# EasyEDA Pro project ACDC_双向.eprj, board 三相（TO-277）
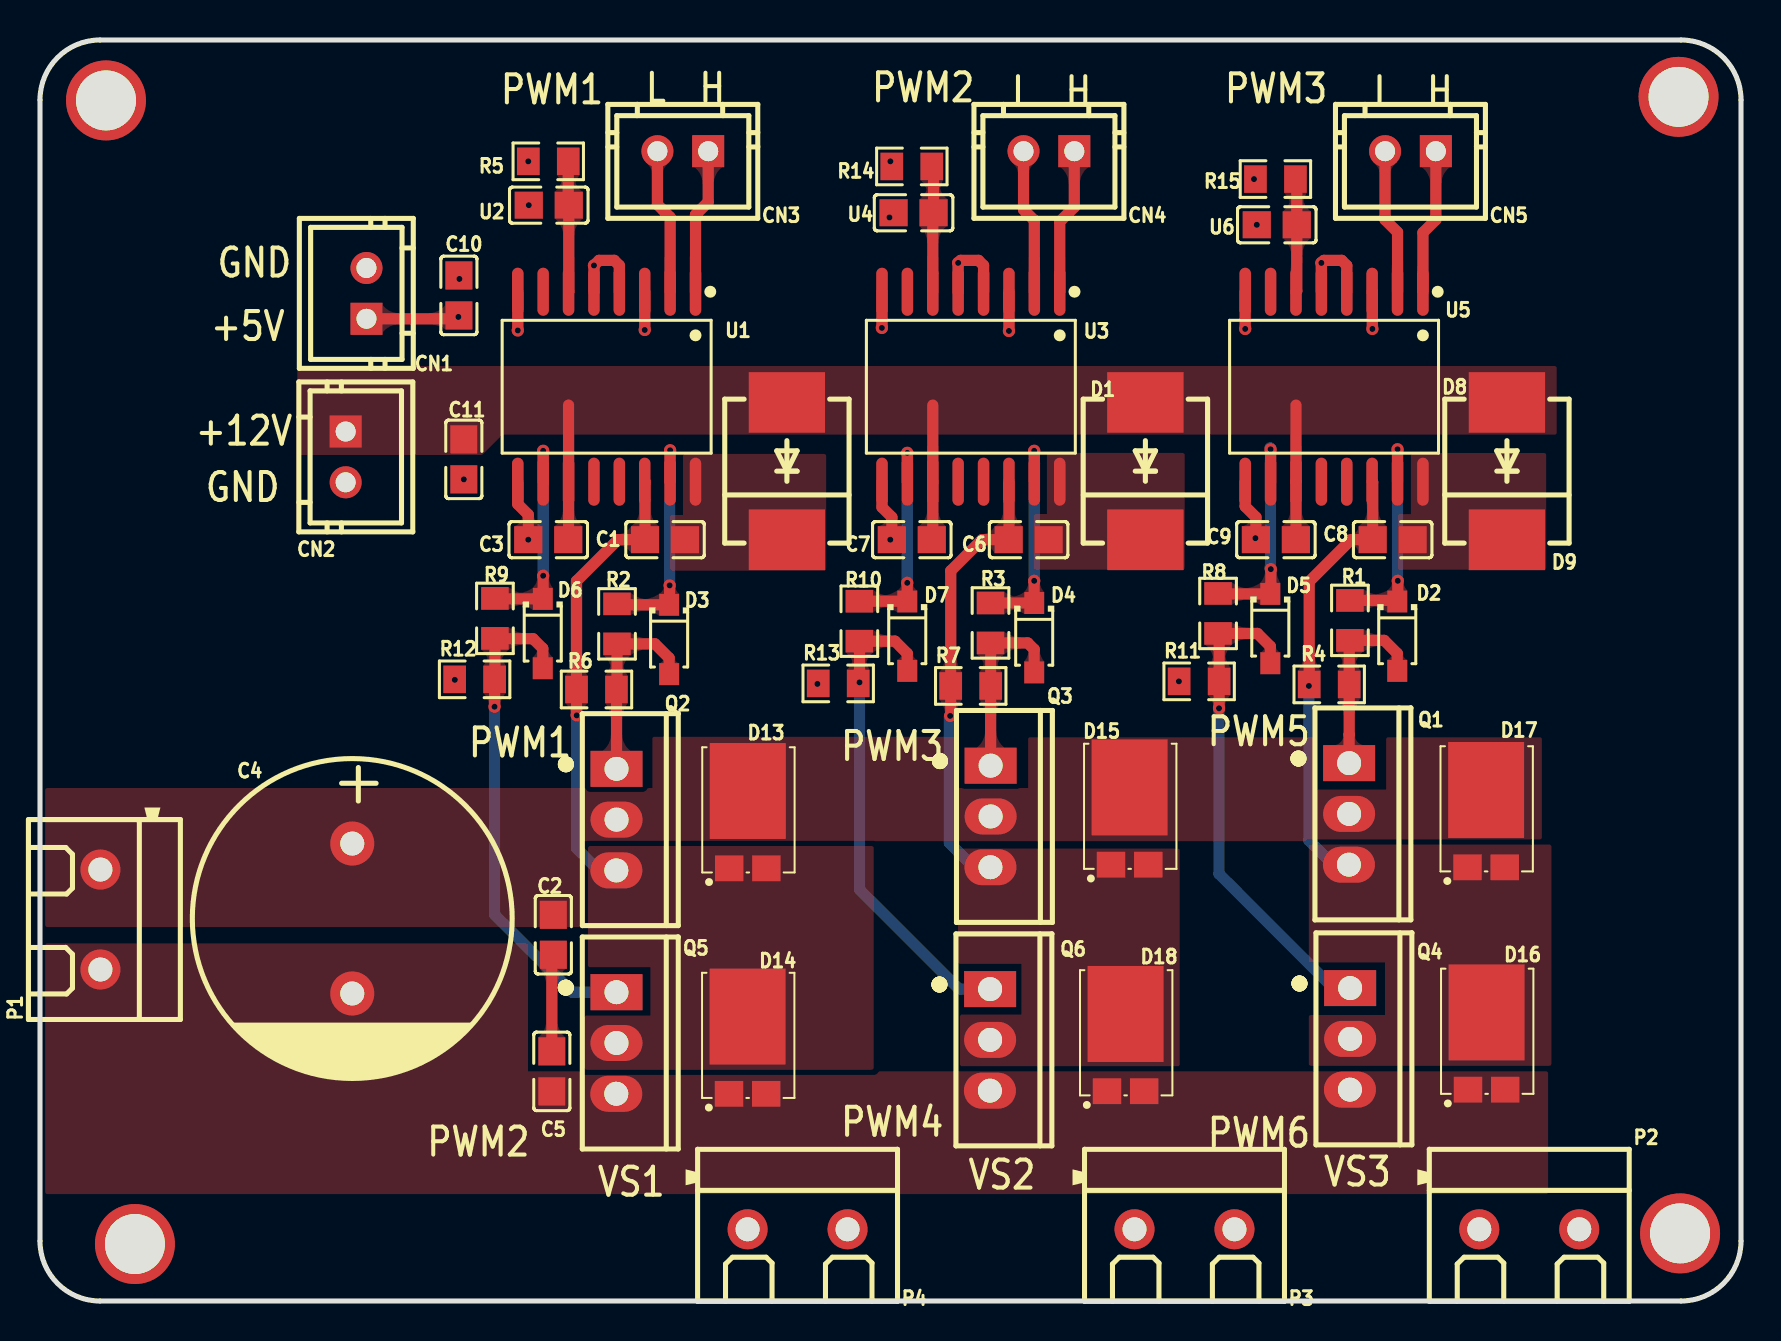
[diagram p11: board, top side]
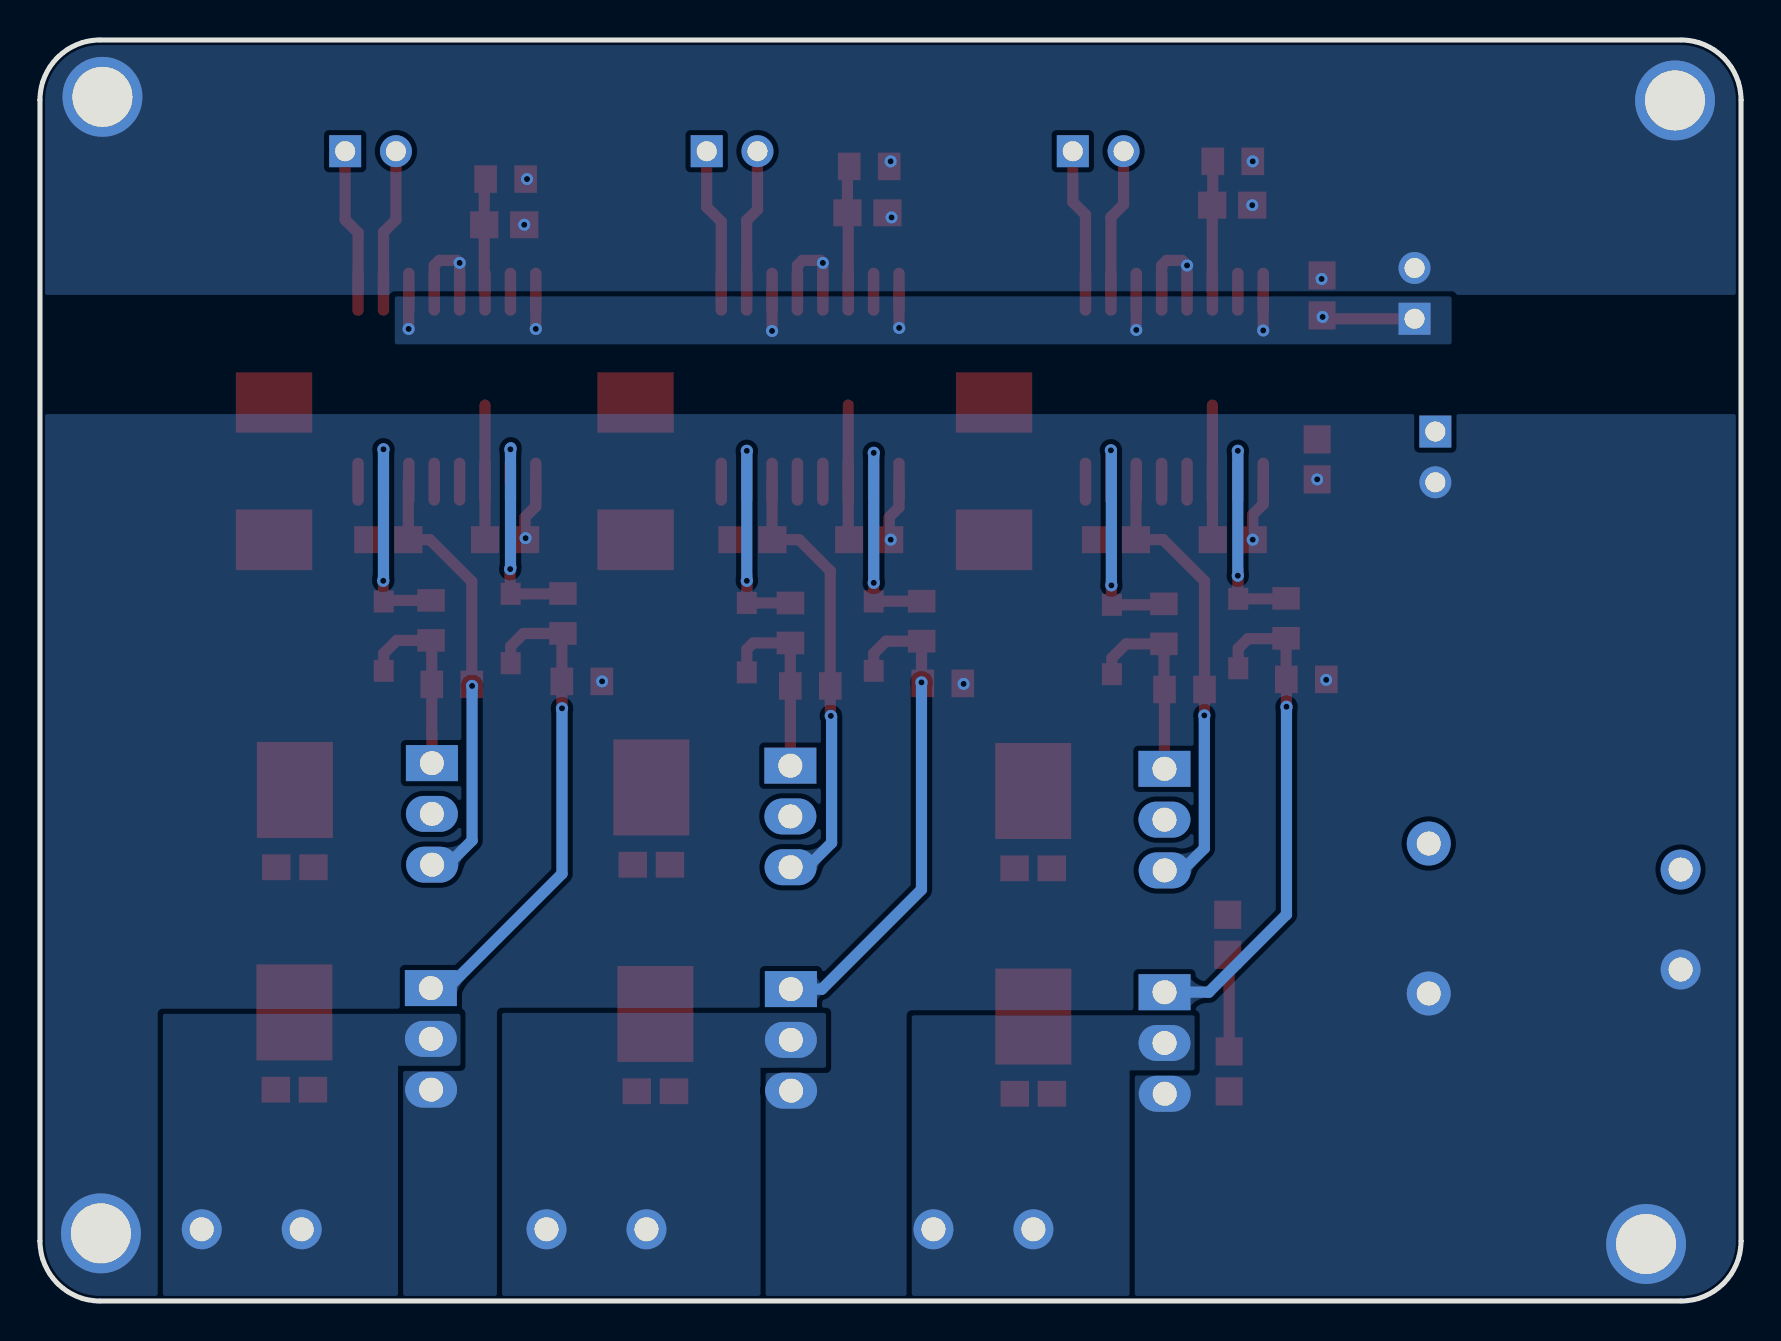
[diagram p12: board, bottom side, seen from below]

Outline 85.09 x 63.07 mm; copper layers: Top Layer, Bottom Layer. Coordinates in mm from the lower left corner of the outline.
Outline path: 0,60.07 0,3 arc(0.88,0.88) 3,0 82.09,0 arc(84.21,0.88) 85.09,3 85.09,60.07 arc(84.21,62.19) 82.09,63.07 3,63.07 arc(0.88,62.19) 0,60.07
Stack: Top Layer 0.035mm / Dielectric1 1.51mm FR4 er 4.5 / Bottom Layer 0.035mm

## Design rules (mm)
template: 自定义配置
spacing copperThickness1oz (default): track to track 0.102, other pairs 0.152 to 0.3
spacing copperThickness2oz: track to track 0.203, other pairs 0.152 to 0.3
track width copperThickness1oz (default): min 0.127, default 0.254, max 2.54
track width copperThickness2oz: min 0.203, default 0.254, max 2.54
differential pair differentialPair (default): width min 0.127, default 0.254, max 2.54; gap min 0.152, default 0.152
via viaSize (default): diameter min 0.5, default 0.61, max 10; hole min 0.3, default 0.305, max 6.3

## Placement (name value [footprint] x y rotation side)
C1  1uF  [C0805]  31.27 38.08 0 top
C2  100nF  [C0805]  25.68 18.32 90 top
C3  1uF  [C0805]  25.42 38.08 0 top
C4  470uF  [CAP-TH_BD16.0-P7.50-D1.2-FD]  15.62 19.13 270 top
C5  100nF  [C0805]  25.6 11.49 90 top
C6  1uF  [C0805]  49.45 38.08 0 top
C7  1uF  [C0805]  43.61 38.08 0 top
C8  1uF  [C0805]  67.67 38.08 0 top
C9  1uF  [C0805]  61.82 38.08 0 top
C10  100nF  [C0805]  20.95 50.3 270 top
C11  100nF  [C0805]  21.2 42.1 90 top
CN1  CON2-2.54*2P  [CONN-TH_2P-P2.54-V]  16.33 50.4 90 top
CN2  CON2-2.54*2P  [CONN-TH_2P-P2.54-V]  15.29 42.22 270 top
CN3  CON2-2.54*2P  [CONN-TH_2P-P2.54-V]  32.16 57.51 180 top
CN4  CON2-2.54*2P  [CONN-TH_2P-P2.54-V]  50.47 57.51 180 top
CN5  CON2-2.54*2P  [CONN-TH_2P-P2.54-V]  68.55 57.51 180 top
D1  RS3MC  [SMC_L7.1-W6.2-LS8.1-R-RD]  37.36 41.51 90 top
D2  1N4148W  [SOD-123F_L2.7-W1.6-LS3.8-RD]  67.89 33.25 270 top
D3  1N4148W  [SOD-123F_L2.7-W1.6-LS3.8-RD]  31.47 33.09 270 top
D4  1N4148W  [SOD-123F_L2.7-W1.6-LS3.8-RD]  49.73 33.18 270 top
D5  1N4148W  [SOD-123F_L2.7-W1.6-LS3.8-RD]  61.54 33.63 270 top
D6  1N4148W  [SOD-123F_L2.7-W1.6-LS3.8-RD]  25.15 33.39 270 top
D7  1N4148W  [SOD-123F_L2.7-W1.6-LS3.8-RD]  43.38 33.25 270 top
D8  RS3MC  [SMC_L7.1-W6.2-LS8.1-R-RD]  55.3 41.51 90 top
D9  RS3MC  [SMC_L7.1-W6.2-LS8.1-R-RD]  73.38 41.51 90 top
D13  ST20100L  [TO-277_3P-L5.7-W4.2-LS6.5-BR]  35.41 23.58 270 top
D14  ST20100L  [TO-277_3P-L5.7-W4.2-LS6.5-BR]  35.4 12.3 270 top
D15  ST20100L  [TO-277_3P-L5.7-W4.2-LS6.5-BR]  54.51 23.75 270 top
D16  ST20100L  [TO-277_3P-L5.7-W4.2-LS6.5-BR]  72.36 12.5 270 top
D17  ST20100L  [TO-277_3P-L5.7-W4.2-LS6.5-BR]  72.34 23.63 270 top
D18  ST20100L  [TO-277_3P-L5.7-W4.2-LS6.5-BR]  54.31 12.43 270 top
NOREF  -  [Pad_e102]  82.04 3.38 0 top
NOREF#2  -  [Pad_e101]  4.75 2.85 0 top
NOREF#3  -  [Pad_e100]  81.97 60.23 0 top
NOREF#4  -  [Pad_e98]  3.3 60.05 0 top
P1  KF301-2P接线端子  [CONN-TH_XY301V-A-5.0-2P]  3.02 19.08 90 top
P2  KF301-2P接线端子  [CONN-TH_XY301V-A-5.0-2P]  74.5 3.59 180 top
P3  KF301-2P接线端子  [CONN-TH_XY301V-A-5.0-2P]  57.25 3.59 180 top
P4  KF301-2P接线端子  [CONN-TH_XY301V-A-5.0-2P]  37.9 3.59 180 top
Q1  CSD19536KCS  [TO-220-3_L10.0-W4.5-P2.54-L]  65.48 24.36 270 top
Q2  CSD19536KCS  [TO-220-3_L10.0-W4.5-P2.54-L]  28.84 24.08 270 top
Q3  CSD19536KCS  [TO-220-3_L10.0-W4.5-P2.54-L]  47.55 24.24 270 top
Q4  CSD19536KCS  [TO-220-3_L10.0-W4.5-P2.54-L]  65.53 13.11 270 top
Q5  CSD19536KCS  [TO-220-3_L10.0-W4.5-P2.54-L]  28.83 12.91 270 top
Q6  CSD19536KCS  [TO-220-3_L10.0-W4.5-P2.54-L]  47.52 13.06 270 top
R1  2Ω  [R0805]  65.53 34.04 270 top
R2  2Ω  [R0805]  28.87 33.87 270 top
R3  2Ω  [R0805]  47.55 33.91 270 top
R4  10kΩ  [R0805]  64.49 30.84 0 top
R5  20kΩ  [R0805]  25.42 57 0 top
R6  10kΩ  [R0805]  27.84 30.59 0 top
R7  10kΩ  [R0805]  46.56 30.76 0 top
R8  2Ω  [R0805]  58.93 34.39 270 top
R9  2Ω  [R0805]  22.76 34.14 270 top
R10  2Ω  [R0805]  40.99 34 270 top
R11  10kΩ  [R0805]  57.98 30.99 0 top
R12  10kΩ  [R0805]  21.74 31.09 0 top
R13  10kΩ  [R0805]  39.93 30.89 0 top
R14  20kΩ  [R0805]  43.61 56.75 0 top
R15  20kΩ  [R0805]  61.8 56.12 0 top
U1  UCC21520  [SOIC-16_L10.3-W7.5-P1.27-LS10.3-BL]  28.35 45.73 180 top
U2  100nF  [C0805]  25.45 54.81 0 top
U3  UCC21520  [SOIC-16_L10.3-W7.5-P1.27-LS10.3-BL]  46.56 45.73 180 top
U4  100nF  [C0805]  43.7 54.43 0 top
U5  UCC21520  [SOIC-16_L10.3-W7.5-P1.27-LS10.3-BL]  64.73 45.73 180 top
U6  100nF  [C0805]  61.87 53.83 0 top

## Footprints (pads in the part's own frame, mm; a bottom-side part is the same pattern mirrored in y, then rotated)
C0805
  rect 1.41x1.35 smd: 1(-1,0) 2(1,0)
CAP-TH_BD16.0-P7.50-D1.2-FD
  round 2.2 hole 1.2: 1(-3.75,0) 2(3.75,0)
CONN-TH_2P-P2.54-V
  rect 1.6x1.6 hole 1: 1(-1.27,0)
  round 1.6 hole 1: 2(1.27,0)
CONN-TH_XY301V-A-5.0-2P
  round 2 hole 1.2: 1(-2.5,0) 2(2.5,0)
Pad_e98
  round 4 hole 3: 1(0,0)
Pad_e100
  round 4 hole 3: 1(0,0)
Pad_e101
  round 4 hole 3: 1(0,0)
Pad_e102
  round 4 hole 3: 1(0,0)
R0805
  rect 1.133x1.377 smd: 1(-1,0) 2(1,0)
SMC_L7.1-W6.2-LS8.1-R-RD
  rect 3.03x3.82 smd: 1(3.435,0) 2(-3.435,0)
SOD-123F_L2.7-W1.6-LS3.8-RD
  rect 1.1x1 smd: 1(-1.735,0) 2(1.735,0)
SOIC-16_L10.3-W7.5-P1.27-LS10.3-BL
  oval 0.574x2.401 smd: 1(-4.445,-4.75) 2(-3.175,-4.75) 3(-1.905,-4.75) 4(-0.635,-4.75) 5(0.635,-4.75) 6(1.905,-4.75) 7(3.175,-4.75) 8(4.445,-4.75) 9(4.445,4.75) 10(3.175,4.75) 11(1.905,4.75) 12(0.635,4.75) 13(-0.635,4.75) 14(-1.905,4.75) 15(-3.175,4.75) 16(-4.445,4.75)
TO-220-3_L10.0-W4.5-P2.54-L
  rect 1.8x2.6 hole 1.2: 1(-2.54,0.005)
  oval 1.8x2.6 hole 1.2: 2(0,0.005) 3(2.54,-0.005)
TO-277_3P-L5.7-W4.2-LS6.5-BR
  rect 1.29x1.423 smd: 1(1.933,-0.93) 3(1.933,0.93)
  rect 4.8x3.8 smd: 2(-1.933,0)

## Nets
As in the schematic, except:
DGND: C10.1 CN1.2 NOREF#3.1 NOREF#4.1 R5.1 R14.1 R15.1 U1.4 U1.5 U2.1 U3.4 U3.5 U4.1 U5.4 U5.5 U6.1
PGND: C3.1 C4.2 C5.1 C7.1 C9.1 C11.1 CN2.2 D14.1 D14.3 D16.1 D16.3 D18.1 D18.3 NOREF.1 NOREF#2.1 P1.1 Q4.3 Q5.3 Q6.3 R11.1 R12.1 R13.1 U1.9 U3.9 U5.9

Pads without a net: U1 7 12 13; U3 7 12 13; U5 7 12 13

## Via types
v1: diameter 0.61, hole 0.305, Top Layer to Bottom Layer, 42 vias

## Routing (per net, layer and track width the routed paths; a pad name or vN(x,y) marks a point on that pad's centre or on a via; arc(x,y) is an arc through that point)
+5V: length 16
  Top Layer w0.559: v1(66.65,48.62) 66.65,50.47 U5.3 ; v1(20.93,49.22) 20.84,49.13 CN1.1 ; U5.8 v1(60.29,48.62) ; U1.3 v1(30.25,48.57) ; U3.8 42.12,48.68 v1(42.11,48.67) ; U3.3 v1(48.47,48.52) ; U1.8 v1(23.9,48.54)
+12V: length 20.2
  Top Layer w0.559: 44.66,44.81 U3.11 44.66,38.13 C7.2 ; C3.2 26.44,38.1 U1.11 26.44,44.81 ; C9.2 62.83,38.08 U5.11 62.83,44.81
DGND: length 12.5
  Top Layer w0.559: U1.5 v1(27.71,51.8) 27.97,52.05 28.73,52.05 28.98,51.8 U1.4 ; 64.1,50.48 v1(64.1,51.92) 64.22,52.05 65.11,52.05 65.37,51.8 U5.4 ; U3.4 47.2,51.8 46.95,52.05 46.06,52.05 v1(45.93,51.92) U3.5
  vias: v1(20.98,51.12) v1(24.42,57) v1(24.45,54.81) v1(42.49,54.2) v1(42.54,57) v1(60.73,56.12) v1(60.87,53.83)
PGND: length 9.5
  Top Layer w0.559: U3.9 42.12,39.7 42.61,39.21 C7.1 ; 60.82,38.16 61.04,38.16 ; 60.82,38.16 v1(60.8,38.16) ; 60.82,38.16 60.82,39.21 60.29,39.74 U5.9 ; v1(24.42,38.08) 24.42,39.33 23.9,39.86 U1.9
  vias: v1(20.75,31.07) v1(21.2,41.1) v1(38.89,30.87) v1(42.53,38.08) v1(56.97,30.99)
H1: length 11.9
  Top Layer w0.559: v1(31.5,35.79) 31.5,34.85 D3.1 28.91,34.82 R2.1 ; v1(31.52,42.55) U1.15
  Bottom Layer w0.559: v1(31.52,42.55) 31.5,42.52 v1(31.5,35.79)
H2: length 11.3
  Top Layer w0.559: v1(49.73,42.52) 49.74,42.52 U3.15 ; v1(49.73,36.02) 49.73,34.92 ; 49.73,34.91 R3.1
  Bottom Layer w0.559: v1(49.73,42.52) v1(49.73,36.02)
H3: length 11.6
  Top Layer w0.559: U5.15 v1(67.91,42.6) ; D2.1 67.84,35.04 67.79,35.04 ; 67.79,35.04 R1.1 ; 67.79,35.04 67.92,35.18 v1(67.92,36.02)
  Bottom Layer w0.559: v1(67.91,42.6) 67.91,36.03 v1(67.92,36.02)
L1: length 11.4
  Top Layer w0.559: U1.10 v1(25.17,42.52) ; R9.1 22.78,35.12 D6.1 25.17,35.14 v1(25.17,36.28)
  Bottom Layer w0.559: v1(25.17,42.52) v1(25.17,36.28)
L2: length 11.3
  Top Layer w0.559: v1(43.38,42.42) 43.39,42.42 U3.10 ; R10.1 43.37,35 D7.1 v1(43.38,35.92)
  Bottom Layer w0.559: v1(43.38,35.92) v1(43.38,42.42)
L3: length 11.5
  Top Layer w0.559: U5.10 v1(61.56,42.6) ; R8.1 58.95,35.37 D5.1 61.57,35.4 v1(61.57,36.61)
  Bottom Layer w0.559: 61.56,36.62 v1(61.57,36.61) ; 61.53,42.68 61.55,42.66 61.55,36.71 61.53,36.69
PWMH1: length 7.3
  Top Layer w0.559: 33.43,57.51 33.43,54.97 32.79,54.34 U1.1
PWMH2: length 7.3
  Top Layer w0.559: U3.1 51.01,53.99 51.74,54.72 CN4.1
PWMH3: length 7.3
  Top Layer w0.559: U5.1 69.18,53.44 69.82,54.08 CN5.1
PWML1: length 7.3
  Top Layer w0.559: U1.2 31.52,54.21 30.89,54.84 CN3.2
PWML2: length 7.3
  Top Layer w0.559: U3.2 49.74,54.05 49.2,54.59 CN4.2
PWML3: length 7.3
  Top Layer w0.559: U5.2 67.91,53.46 67.28,54.08 CN5.2
VS1: length 23
  Top Layer w0.559: v1(26.85,29.29) 26.84,29.3 R6.1 26.84,36.01 28.91,38.08 C1.1 30.27,40.96 U1.14
  Bottom Layer w0.559: Q2.3 27.95,21.54 26.85,22.64 v1(26.85,29.29)
VS2: length 22.9
  Top Layer w0.559: 48.74,38.08 C6.1 47.12,38.08 45.56,36.52 R7.1 45.56,29.29 v1(45.53,29.27) ; U3.14 48.47,38.1
  Bottom Layer w0.559: v1(45.53,29.27) 45.49,29.23 45.49,22.92 46.71,21.7 Q3.3
VS3: length 22.4
  Top Layer w0.559: v1(63.47,30.76) 63.47,30.82 R4.1 63.49,35.99 65.58,38.08 C8.1 66.67,40.95 U5.14
  Bottom Layer w0.559: Q1.3 64.69,21.82 63.47,23.04 v1(63.47,30.76)
$1N1727: length 25.1
  Top Layer w0.559: v1(22.74,29.72) 22.74,29.73 R12.2 22.76,31.11 R9.2 22.77,33.13 24.66,33.13 25.15,32.64 D6.2
  Bottom Layer w0.559: v1(22.74,29.72) 22.74,19.33 26.62,15.45 Q5.1
$1N1729: length 10
  Top Layer w0.559: Q2.1 28.84,30.58 R6.2 28.87,30.61 R2.2 30.76,32.87 31.47,32.16 31.47,31.35
$1N1731: length 9.6
  Top Layer w0.559: Q3.1 47.55,30.76 R7.2 47.56,32.9 R3.2 49.41,32.91 49.73,32.59 D4.2
$1N1733: length 24.5
  Top Layer w0.559: D7.2 43.38,32.39 42.77,33 R10.2 41,32.99 v1(41,30.94)
  Bottom Layer w0.559: Q6.1 45.97,15.6 41,20.58 v1(41,30.94)
$1N1740: length 6.3
  Top Layer w0.559: R14.2 44.7,56.66 U4.2 44.66,54.39 U3.6
$1N1748: length 6.5
  Top Layer w0.559: R5.2 26.42,54.84 U2.2 26.45,50.49 U1.6
$1N1779: length 4.9
  Top Layer w0.559: C2.1 25.6,17.24 C5.2
$1N1953: length 9.7
  Top Layer w0.559: Q1.1 65.49,28.33 65.49,28.34 R4.2 65.49,33.01 R1.2 67.24,33.04 67.89,32.39 D2.2
$1N2084: length 24.7
  Top Layer w0.559: v1(58.98,29.65) 58.98,29.65 R11.2 58.98,33.34 R8.2 60.9,33.39 61.54,32.75 D5.2
  Bottom Layer w0.559: v1(58.98,29.65) 58.98,21.37 64.69,15.65 Q4.1
$1N2554: length 5.7
  Top Layer w0.559: R15.2 62.87,56.05 U6.2 62.87,50.52 U5.6

## Copper pours and planes (outline as drawn; the poured copper is in the pictures)
+5V on Bottom Layer: 14.48,50.25 67.34,50.25 67.34,47.85 14.48,47.85
+12V on Top Layer: 12.88,42.32 22.12,42.32 23.14,43.34 75.87,43.34 75.87,46.77 12.87,46.77 12.87,42.33
+VIN on Top Layer: 75.13,23 27.18,23 27.18,18.7 -0.12,18.7 -0.12,25.66 30.63,25.66 30.63,28.22 45.85,28.22 45.85,25.66 49.43,25.66 49.43,28.2 63.8,28.2 63.8,25.58 67.34,25.58 67.34,28.2 75.13,28.2
DGND on Bottom Layer: -0.48,63.35 85.51,63.35 85.51,50.32 -0.48,50.32
PGND on Top Layer: 24.41,11.49 75.44,11.49 75.44,5.35 -0.07,5.35 -0.07,17.89 24.41,17.89
PGND on Bottom Layer: -0.61,44.36 85.74,44.36 85.74,-0.66 -0.61,-0.66
VS1 on Top Layer: 27.41,22.76 41.71,22.76 41.71,11.57 27.23,11.57 27.23,14.28 30.53,14.28 30.53,16.69 27.41,16.69
VS1 on Bottom Layer: 27.33,14.29 41.48,14.29 41.48,-0.12 30.58,-0.12 30.58,11.54 27.33,11.54
VS2 on Top Layer: 45.92,22.63 57.01,22.63 57.01,11.72 46.02,11.72 46.02,14.33 49.09,14.33 49.09,16.87 45.92,16.87
VS2 on Bottom Layer: 45.77,14.42 61.98,14.42 61.98,0.11 49.05,0.11 49.05,11.66 45.77,11.66
VS3 on Top Layer: 63.47,22.83 75.61,22.83 75.61,11.77 63.47,11.77 63.47,14.3 67.28,14.3 67.28,16.94 63.47,16.94
VS3 on Bottom Layer: 64.06,14.36 78.94,14.36 78.94,-0.55 67.18,-0.55 67.18,11.77 64.06,11.77
$1N1758 on Top Layer: 50.37,42.42 50.37,39.36 49.71,39.36 49.71,36.58 57.26,36.58 57.26,42.42
$1N1759 on Top Layer: 32.17,42.36 32.17,39.31 31.52,39.31 31.52,36.53 39.33,36.53 39.33,42.37 32.18,42.37
$1N2562 on Top Layer: 68.58,42.41 68.58,39.36 67.92,39.36 67.92,36.58 75.34,36.58 75.34,42.41

Small or netless copper shapes (teardrops, artwork), in the pictures only: 158 on Top Layer, 24 on Bottom Layer

## Text on the board
Top Silkscreen Layer: +12V | GND | +5V | PWM2 | PWM1 | VS1 | L | H | PWM3 | PWM4 | VS2 | PWM5 | PWM6 | VS3
